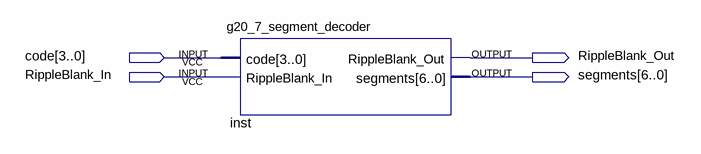
[diagram p0: schematic sheet]
// Quartus schematic g20_Decoder.bdf as structural Verilog: 1 symbols, 4 pins
module g20_Decoder (
  input  [3:0] code,
  input  RippleBlank_In,
  output RippleBlank_Out,
  output [6:0] segments
);

  g20_7_segment_decoder inst (
    .code(code), .RippleBlank_In(RippleBlank_In), .RippleBlank_Out(RippleBlank_Out), .segments(segments));
endmodule
